# EAGLE design Display (EAGLE 8.4.2)
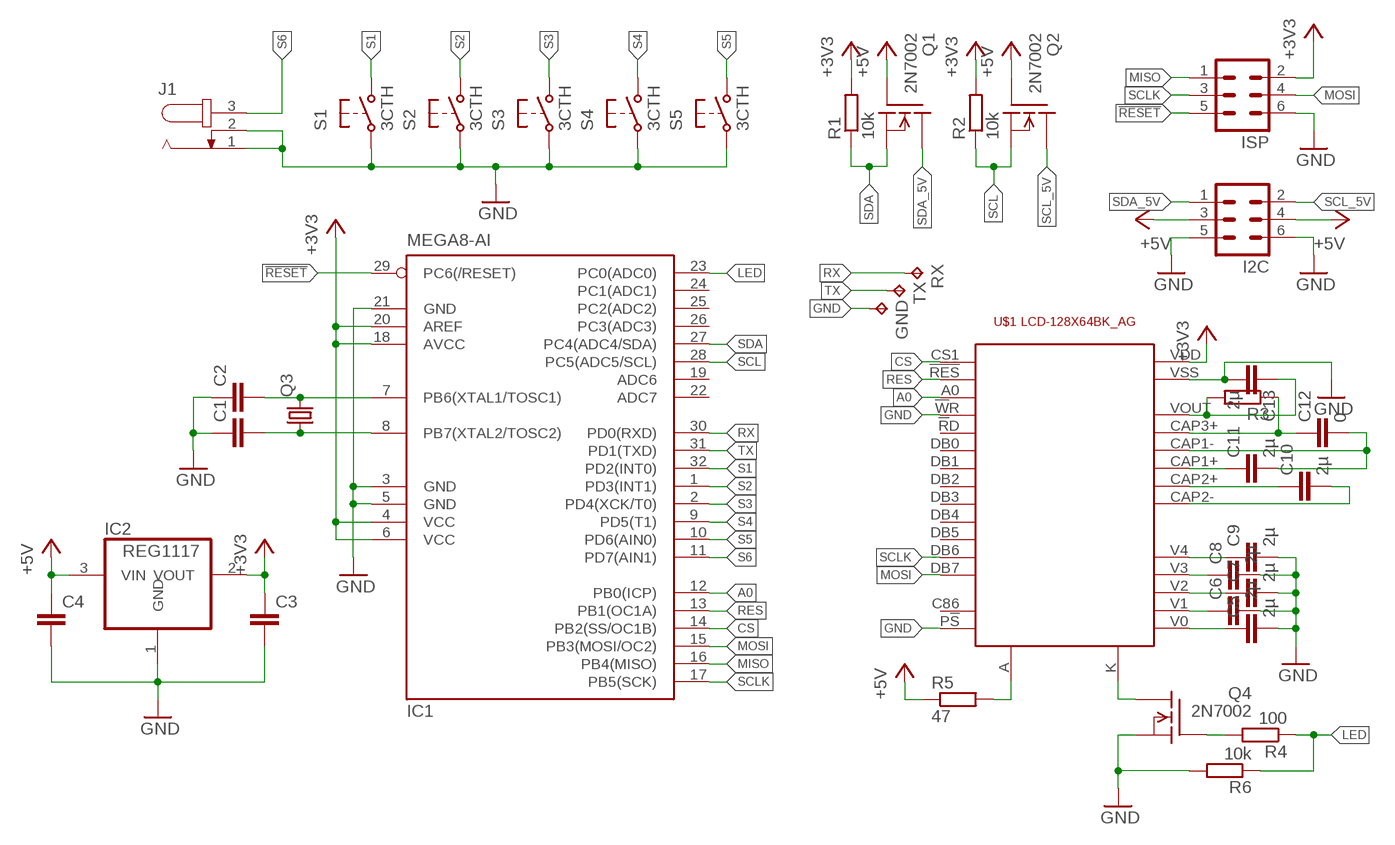
[diagram p0: schematic, sheet 1]

## Parts
C1  C-EUC0805K  [C0805K]
C2  C-EUC0805K  [C0805K]
C3  C-EUC0805K  [C0805K]
C4  C-EUC0805K  [C0805K]
C5  2µ  C-EUC0805K  [C0805K]
C6  2µ  C-EUC0805K  [C0805K]
C7  2µ  C-EUC0805K  [C0805K]
C8  2µ  C-EUC0805K  [C0805K]
C9  2µ  C-EUC0805K  [C0805K]
C10  2µ  C-EUC0805K  [C0805K]
C11  2µ  C-EUC0805K  [C0805K]
C12  0  C-EUC0805K  [C0805K]
C13  2µ  C-EUC0805K  [C0805K]
GND  TPPAD1-13  [P1-13]
I2C  ML6  [ML6]
IC1  MEGA8-AI  [TQFP32-08]
IC2  REG1117  [SOT223]
ISP  ML6  [ML6]
J1  JACK-PLUG0  [SPC4077]
Q1  2N7002  [SOT23]
Q2  2N7002  [SOT23]
Q3  CRYSTALHC49UP  [HC49UP]
Q4  2N7002  [SOT23]
R1  10k  R-EU_R0805  [R0805]
R2  10k  R-EU_R0805  [R0805]
R3  R-EU_R0805  [R0805]
R4  100  R-EU_R0805  [R0805]
R5  47  R-EU_0207/10  [0207/10]
R6  10k  R-EU_R0805  [R0805]
RX  TPPAD1-13  [P1-13]
S1  3CTH  [3CTH]
S2  3CTH  [3CTH]
S3  3CTH  [3CTH]
S4  3CTH  [3CTH]
S5  3CTH  [3CTH]
TX  TPPAD1-13  [P1-13]
U$1  LCD-128X64BK_AG  [LCD-128X64BK_AG]

## Nets
!RESET: IC1.29(PC6(/RESET)) ISP.5
+3V3: C3.1 IC1.4(VCC) IC1.6(VCC) IC1.18(AVCC) IC1.20(AREF) IC2.2(VOUT) ISP.2 R1.2 R2.2 U$1.VDD
+5V: C4.1 I2C.3 I2C.4 IC2.3(VIN) Q1.1(G) Q2.1(G) R5.1
A0: IC1.12(PB0(ICP)) U$1.A0
CS: IC1.14(PB2(SS/OC1B)) U$1.CS1
GND: C1.1 C2.1 C3.2 C4.2 C5.2 C6.2 C7.2 C8.2 C9.2 C13.2 GND.TP I2C.5 I2C.6 IC1.3(GND) IC1.5(GND) IC1.21(GND) IC2.1(GND) ISP.6 J1.1 J1.2 Q4.2(S) R6.2 S1.3(P) S1.4(P) S2.3(P) S2.4(P) S3.3(P) S3.4(P) S4.3(P) S4.4(P) S5.3(P) S5.4(P) U$1.!W!R U$1.P!S U$1.VSS
LED: IC1.23(PC0(ADC0)) R4.1 R6.1
MISO: IC1.16(PB4(MISO)) ISP.1
MOSI: IC1.15(PB3(MOSI/OC2)) ISP.4 U$1.DB7
N$1: Q4.3(D) U$1.K
N$2: C1.2 IC1.8(PB7(XTAL2/TOSC2)) Q3.1
N$3: C2.2 IC1.7(PB6(XTAL1/TOSC1)) Q3.2
N$4: C13.1 R3.2 U$1.VOUT
N$5: Q4.1(G) R4.2
N$6: C12.1 R3.1 U$1.CAP3+
N$7: R5.2 U$1.A
N$8: C11.2 C12.2 U$1.CAP1-
N$9: C11.1 U$1.CAP1+
N$10: C10.1 U$1.CAP2+
N$11: C10.2 U$1.CAP2-
N$14: C9.1 U$1.V4
N$15: C8.1 U$1.V3
N$16: C7.1 U$1.V2
N$17: C6.1 U$1.V1
N$18: C5.1 U$1.V0
RES: IC1.13(PB1(OC1A)) U$1.!RES
RX: IC1.30(PD0(RXD)) RX.TP
S1: IC1.32(PD2(INT0)) S1.1(S) S1.2(S)
S2: IC1.1(PD3(INT1)) S2.1(S) S2.2(S)
S3: IC1.2(PD4(XCK/T0)) S3.1(S) S3.2(S)
S4: IC1.9(PD5(T1)) S4.1(S) S4.2(S)
S5: IC1.10(PD6(AIN0)) S5.1(S) S5.2(S)
S6: IC1.11(PD7(AIN1)) J1.3
SCL: IC1.28(PC5(ADC5/SCL)) Q2.2(S) R2.1
SCL_5V: I2C.2 Q2.3(D)
SCLK: IC1.17(PB5(SCK)) ISP.3 U$1.DB6
SDA: IC1.27(PC4(ADC4/SDA)) Q1.2(S) R1.1
SDA_5V: I2C.1 Q1.3(D)
TX: IC1.31(PD1(TXD)) TX.TP
Unconnected: IC1.19(ADC6) IC1.22(ADC7) IC1.24(PC1(ADC1)) IC1.25(PC2(ADC2)) IC1.26(PC3(ADC3)) U$1.!R!D(/RD) U$1.C86 U$1.DB0 U$1.DB1 U$1.DB2 U$1.DB3 U$1.DB4 U$1.DB5

## Library data of the parts
C1-C13 = resistor:C-EU: CAPACITOR, European symbol
GND RX TX = testpad:TP: Test pad
I2C ISP = con-harting-ml:ML6: HARTING; OC_FARNELL: unknown; OC_NEWARK: unknown
IC1 = atmel:MEGA8: MICROCONTROLLER 8 Kbytes FLASH, 1 kbytes SRAM, 512 bytes EEPROM, USART, 6-channel 10 bit ADC, 2-channel 8 bit ADC Pin compatible with Atmega48, ATMega88, ATMega168 Source: avr.lbr; MPN: ATMEGA8-16AU; OC_FARNELL: 9171371; OC_NEWARK: 73M8863
IC2 = burr-brown:REG1117: 800mA and 1A Low Dropout (LDO) Positive Regulator 1.8V, 2.5V, 2.85V, 3.3V, 5V, and Adj; MPN: REG1117; OC_FARNELL: 1097566; OC_NEWARK: 14P6981
J1 = con-jack:JACK-PLUG: DC POWER JACK Power Jack, DC, Right Angle, Through Hole, Rated 5A at 16VDC, PC Terminals Distributor: Farnell (www.Farnell.de) Drawing: 84N1161.pdf / 84N1162.pdf Manufacturer: SPC Technology (www.spctechnology.com) Type: SPC4077 / SPC 4078; OC_FARNELL: unknown; OC_NEWARK: unknown
Q1 Q2 Q4 = transistors_gaui:2N7002
Q3 = crystal:CRYSTAL: CRYSTAL; OC_FARNELL: unknown; OC_NEWARK: unknown
R1-R6 = resistor:R-EU_: RESISTOR, European symbol
S1-S5 = switch-mec:3CTH: SWITCH TACTILE
U$1 = display-lcd (2):LCD-128X64BK_AG

## Board
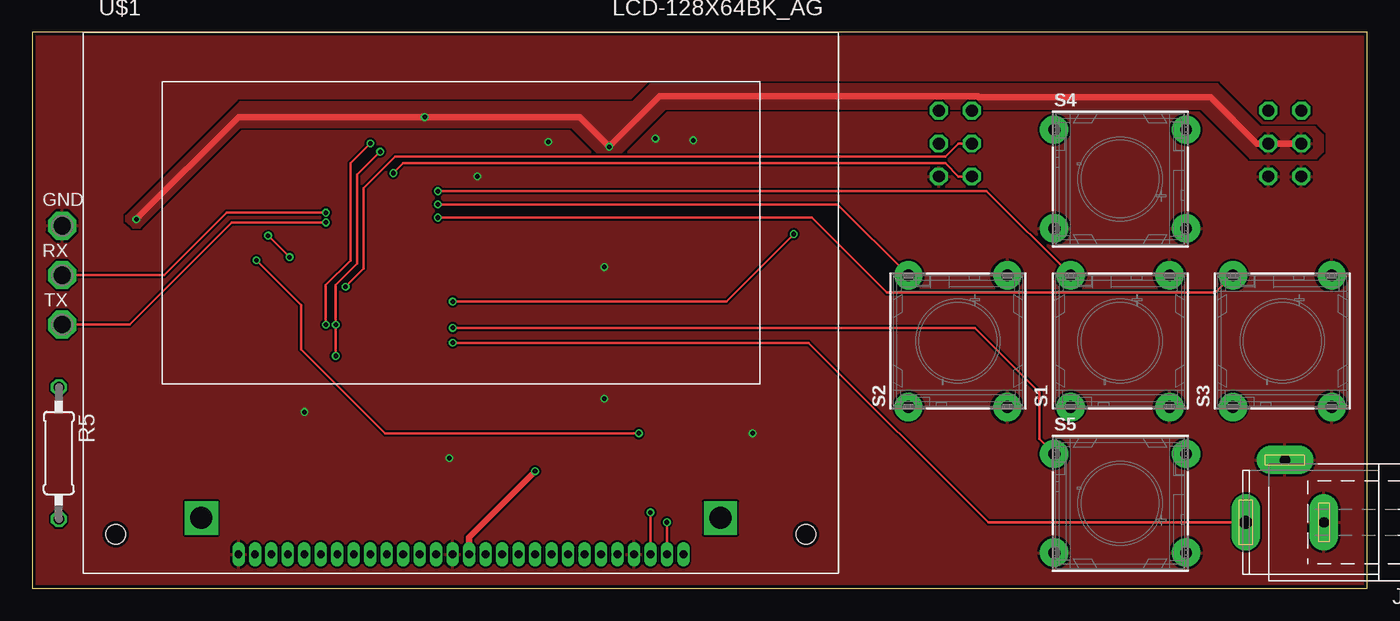
[diagram p1: board, top side]
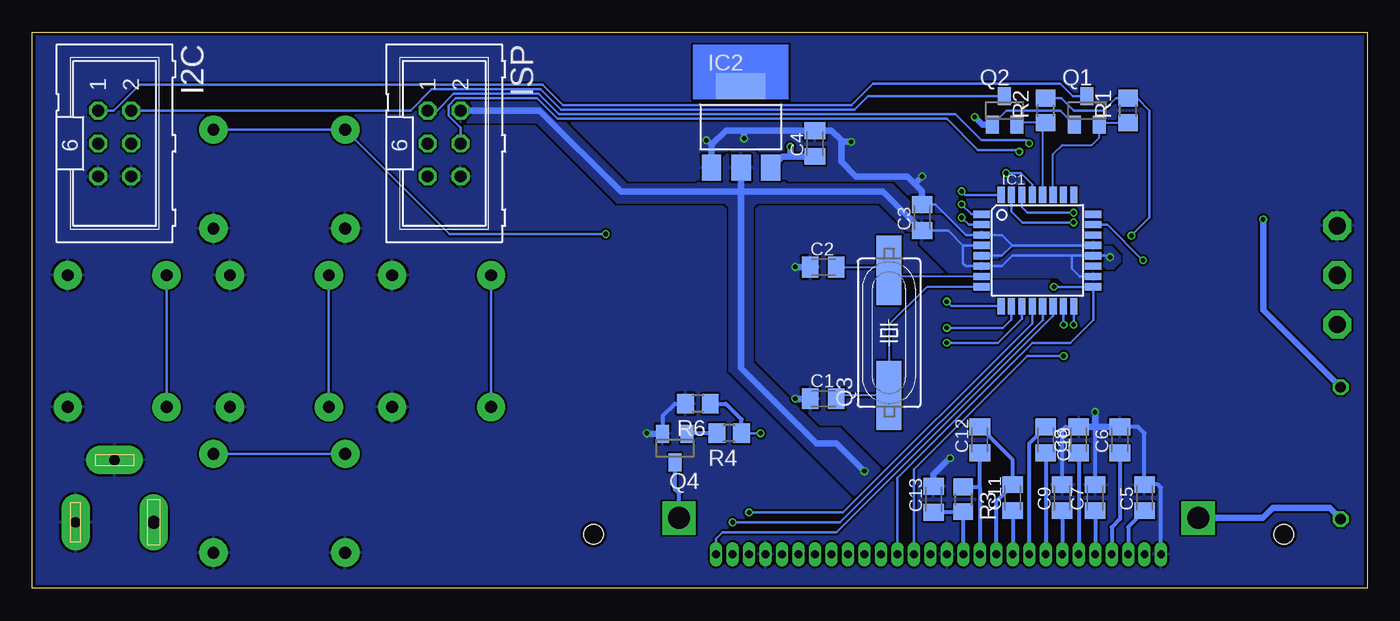
[diagram p2: board, bottom side, seen from below]

Size 102.85 x 42.85 mm. Coordinates in mm from the lower left corner, seen from the top.
Outline: 0,0 102.85,0 102.85,42.85 0,42.85 0,0
Copper layers (1*16): Top 0.018mm / dielectric 1.55mm / Bottom 0.018mm
Design rules "eC_2Layer_PClass6_BaseCopperO18_eCDefault": minimum track width 0.15mm, minimum drill 0.35mm, track to track 0.15mm, track to pad 0.15mm, pad to pad 0.15mm, via to via 0.15mm, smd to smd 0mil, copper to edge 0.25mm, drill to drill 0.35mm, minimum pad ring 0.175mm, minimum via ring 0.125mm, stop-mask expansion 0mil, vias tented up to drill 0.45mm, thermal gap 0.2mm

### Footprints (pad centres in the part's own frame; a part is rotated, then mirrored left to right if it is on the bottom)
C0805K = smd 1.3 x 1.6: 1 -1,0; 2 1,0
P1-13 = drill 1.321 pad 2.159 octagon: TP 0,0
ML6 = drill 0.914 octagon: 1 -2.54,-1.27; 2 -2.54,1.27; 3 0,-1.27; 4 0,1.27; 5 2.54,-1.27; 6 2.54,1.27
TQFP32-08 = smd 1.27 x 0.559: 1 -4.293,2.8; 2 -4.293,2; 3 -4.293,1.2; 4 -4.293,0.4; 5 -4.293,-0.4; 6 -4.293,-1.2; 7 -4.293,-2; 8 -4.293,-2.8; 17 4.293,-2.8; 18 4.293,-2; 19 4.293,-1.2; 20 4.293,-0.4; 21 4.293,0.4; 22 4.293,1.2; 23 4.293,2; 24 4.293,2.8 | smd 0.559 x 1.27: 9 -2.8,-4.293; 10 -2,-4.293; 11 -1.2,-4.293; 12 -0.4,-4.293; 13 0.4,-4.293; 14 1.2,-4.293; 15 2,-4.293; 16 2.8,-4.293; 25 2.8,4.293; 26 2,4.293; 27 1.2,4.293; 28 0.4,4.293; 29 -0.4,4.293; 30 -1.2,4.293; 31 -2,4.293; 32 -2.8,4.293
SOT223 = smd 1.499 x 2.007: 1 -2.261,-3.15; 2 0.025,-3.15; 3 2.311,-3.15 | smd 3.81 x 2.007: 4 0,3.15
SPC4077 = drill 0.8 pad 2.184 long: 1 -3,0; 2 0,-4.8 | drill 1 pad 2.184 long: 3 3,0
SOT23 = smd 1 x 1.4: 1 -0.95,-1.1; 2 0.95,-1.1; 3 0,1.1
HC49UP = smd 5.334 x 1.93: 1 -4.826,0; 2 4.826,0
R0805 = smd 1.3 x 1.5: 1 -0.95,0; 2 0.95,0
0207/10 = drill 0.813 octagon: 1 -5.08,0; 2 5.08,0
3CTH = drill 0.914 pad 2.184: 1 5.08,3.81; 2 -5.08,3.81; 3 5.08,-3.81; 4 -5.08,-3.81
LCD-128X64BK_AG = drill 0.6 long: !R!D 12.065,-20.25; !RES 15.875,-20.25; !W!R 13.335,-20.25; A0 14.605,-20.25; C86 -15.875,-20.25; CAP1+ -5.715,-20.25; CAP1- -4.445,-20.25; CAP2+ -6.985,-20.25; CAP2- -8.255,-20.25; CAP3+ -3.175,-20.25; CS1 17.145,-20.25; DB0 10.795,-20.25; DB1 9.525,-20.25; DB2 8.255,-20.25; DB3 6.985,-20.25; DB4 5.715,-20.25; DB5 4.445,-20.25; DB6 3.175,-20.25; DB7 1.905,-20.25; P!S -17.145,-20.25; V0 -14.605,-20.25; V1 -13.335,-20.25; V2 -12.065,-20.25; V3 -10.795,-20.25; V4 -9.525,-20.25; VDD 0.635,-20.25; VOUT -1.905,-20.25; VSS -0.635,-20.25 | drill 1.7 square: A -20,-17.45; K 20,-17.45 | hole 1.5: -26.6,-18.7; 26.6,-18.7

### Placement (x,y rotation side)
C1  41.91,14.61 0 bottom
C2  41.91,24.77 0 bottom
C3  34.29,28.57 90 bottom
C4  42.55,34.29 90 bottom
C5  17.14,6.99 90 bottom
C6  19.05,11.43 90 bottom
C7  20.95,6.99 90 bottom
C8  22.22,11.43 90 bottom
C9  23.49,6.99 90 bottom
C10  24.76,11.43 270 bottom
C11  27.3,6.99 90 bottom
C12  29.84,11.43 90 bottom
C13  33.4,6.86 90 bottom
GND  2.29,27.94 0 top
I2C  96.52,34.29 270 bottom
IC1  25.4,26.04 0 bottom
IC2  48.26,35.56 0 bottom
ISP  71.12,34.29 270 bottom
J1  96.52,5.08 180 top
Q1  21.59,36.83 0 bottom
Q2  27.94,36.83 0 bottom
Q3  36.83,19.68 90 bottom
Q4  53.34,10.79 180 bottom
R1  18.41,36.83 90 bottom
R2  24.76,36.83 90 bottom
R3  31.11,6.86 270 bottom
R4  49.15,11.94 180 bottom
R5  2.03,10.41 270 top
R6  51.56,14.22 180 bottom
RX  2.29,24.13 0 top
S1  83.82,19.05 90 top
S2  71.32,19.05 90 top
S3  96.32,19.05 90 top
S4  83.82,31.55 0 top
S5  83.82,6.55 0 top
TX  2.29,20.32 0 top
U$1  33.02,22.86 0 top

### Tracks (layer width: path | path; a pad name or v marks a point on that pad's centre or on a via)
!RESET  (via drill 0.35)
  Top 0.2: ISP.5 71.37,31.75 70.36,32.77 28.57,32.77 v27.81,32
  Bottom 0.2: v27.81,32 26.67,32 25.8,31.13 IC1.29
+3V3  (via drill 0.35)
  Top 0.2: v19.81,25.53 v18.16,27.18
  Top 0.508: U$1.VDD 33.66,3.94 v38.73,9.02
  Bottom 0.2: C3.1 32.27,27.57 31.13,26.43 | 22.73,25.64 27.32,25.64 28.12,24.84 IC1.6 30.93,24.84 31.13,25.04 31.13,26.43 | 22.73,25.64 IC1.20 19.92,25.64 v19.81,25.53 | 31.13,26.43 IC1.4 | IC1.18 22.13,24.04 22.73,24.64 22.73,25.64 | R2.2 23.56,37.78 22.61,36.83 20.32,36.83 19.37,37.78 R1.2 17.71,37.78 16.76,36.83 16.76,28.57 v18.16,27.18
  Bottom 0.508: 48.23,30.58 IC2.2 | C3.1 35.23,28.52 35.26,28.52 37.32,30.58 48.23,30.58 | 48.23,30.58 57.51,30.58 63.75,36.83 ISP.2 | v38.73,9.02 40.89,11.18 42.42,11.18 48.23,16.99 48.23,30.58
  pour Bottom (rank 4): 19.05,25.27 19.05,25.65 19.68,26.29 27.18,26.29 28.32,25.15 29.34,25.15 29.84,25.65 29.84,26.67 30.1,26.92 30.99,26.92 32.77,28.7 34.16,28.7 36.58,31.11 44.7,31.11 47.37,33.78 49.02,33.78 49.78,33.02 51.69,31.11 57.02,31.11 63.63,37.72 70.23,37.72 70.74,37.21 70.74,36.45 70.23,35.94 64.01,35.94 57.79,29.72 50.93,29.72 49.53,29.72 49.15,29.34 49.15,16.76 43.31,10.92 39.24,6.86 38.86,6.86 37.21,8.51 37.21,8.89 40.64,12.32 42.29,12.32 47.37,17.4 47.37,20.45 47.37,29.34 46.99,29.72 37.59,29.72 31.88,24 23.88,24 23.11,23.24 20.7,23.24 20.57,23.37 20.57,24.77 20.45,24.89 20.32,24.89 20.07,24.64 19.56,24.64 19.05,25.15
+5V  (via drill 0.35)
  Top 0.508: I2C.3 I2C.4 94.36,34.29 90.81,37.85 72.92,37.85 72.84,37.92 48.33,37.92 v44.45,34.04 42.16,36.32 v30.23,36.32 15.88,36.32 v8,28.45
  Bottom 0.2: Q1.1 23.64,36.83 27.79,36.83 Q2.1
  Bottom 0.508: C4.1 44.32,33.29 | 44.32,33.29 45.07,33.29 IC2.3 | 44.32,33.29 44.45,33.42 v44.45,34.04 | Q2.1 29.63,35.73 v30.23,36.32 | v8,28.45 8,21.46 R5.1
  pour Top (rank 4): 99.44,34.92 98.81,35.56 94.62,35.56 91.31,38.86 47.62,38.86 46.23,37.47 16,37.47 7.24,28.7 7.24,28.32 7.75,27.81 8.26,27.81 16,35.56 41.53,35.56 43.94,33.15 44.96,33.15 48.77,36.96 49.28,36.96 90.04,36.96 93.85,33.15 98.93,33.15 99.44,33.66
A0  (via drill 0.35)
  Top 0.2: v47.62,5.84 U$1.A0
  Bottom 0.2: IC1.12 25.8,20.43 40.39,5.84 v47.62,5.84
CS
  Bottom 0.2: IC1.14 24.2,21 40.88,4.32 49.66,4.32 50.16,3.81 U$1.CS1
GND  (via drill 0.35)
  Bottom 0.2: 27.32,26.43 IC1.21 | 27.32,26.43 28.12,27.23 IC1.3 30.92,27.23 33.26,29.57 C3.2 | IC1.5 28.12,25.64 27.32,26.43
  Bottom 0.305: U$1.P!S 15.88,7.75 16.13,8 17.13,8 C5.2 17.14,11.94 17.65,12.45 19.03,12.45 C6.2 | C7.2 20.95,12.43 | C9.2 23.49,12.19 23.24,12.45 22.24,12.45 C8.2 | R6.2 53.34,14.22 54.29,13.27 Q4.2
  Bottom 0.508: IC2.1 50.52,34.19 | 50.52,34.19 49.42,35.29 C4.2 41.26,35.29 40.51,34.54 40.51,32.89 39.37,31.75 35.43,31.75 34.29,30.61 C3.2 | C6.2 20.95,12.43 | C8.2 20.95,12.43 | v32.13,10.03 33.4,8.76 C13.2 | 20.95,12.43 v20.95,13.59 | C2.1 v44.07,24.77 | C1.1 v44.07,14.61 | Q4.2 55.46,11.89 v55.5,11.94 | 34.86,31.18 v34.29,31.75 | 50.52,34.19 50.88,34.54 v50.93,34.54 | 48.01,35.29 v48.01,34.67 | 40.83,34.86 40.39,34.42 v39.75,34.42
  pour Bottom (rank 6): -0.25,43.05 103.12,43.05 103.12,-0.13 -0.25,-0.13
  pour Top (rank 6): -0.25,43.05 103.12,43.05 103.12,-0.13 -0.25,-0.13
LED  (via drill 0.35)
  Top 0.2: v17.26,25.28 20.7,21.84 20.7,18.41 27.18,11.94 v46.74,11.94
  Bottom 0.2: IC1.23 20.02,28.04 v17.26,25.28 | v46.74,11.94 48.07,11.94 48.2,12.06
  Bottom 0.305: R4.1 48.2,12.06 48.2,13.02 49.4,14.22 R6.1
MISO  (via drill 0.35)
  Top 0.2: v26.04,34.29 24.51,32.77 24.51,25.27 22.61,23.37 v22.61,20.32
  Bottom 0.2: ISP.1 71.67,36.83 70.38,38.12 63.83,38.12 62.26,36.54 31.71,36.54 29.72,34.54 26.29,34.54 v26.04,34.29 | v22.61,20.32 v22.6,20.33 IC1.16
MOSI  (via drill 0.35)
  Top 0.2: v23.37,17.91 v23.37,20.32 23.37,23.37 25.02,25.02 25.02,31.88 v26.8,33.66
  Bottom 0.2: ISP.4 69.85,35.51 70.79,36.44 70.79,37.22 70.24,37.77 63.98,37.77 62.4,36.19 32.38,36.19 29.97,33.78 26.92,33.78 v26.8,33.66 | v23.37,20.32 23.4,20.35 IC1.15 | U$1.DB7 34.92,9.15 26.17,17.91 v23.37,17.91
N$1
  Bottom 0.305: U$1.K 53.02,7.3 53.34,7.62 Q4.3
N$2
  Bottom 0.15: C1.2 40.66,14.86 36.96,14.86 | 36.96,14.86 Q3.1 | IC1.8 33.91,23.23 36.83,20.32 36.83,14.99 36.96,14.86
N$3
  Bottom 0.15: IC1.7 36.35,24.04 Q3.2 37.08,24.77 C2.2
N$4
  Bottom 0.305: U$1.VOUT R3.2 31.16,5.86 C13.1
N$5
  Bottom 0.305: R4.2 52.35,11.94 Q4.1
N$6
  Bottom 0.305: 29.84,7.75 U$1.CAP3+ | 29.84,7.75 C12.1 | R3.1 29.91,7.81 29.84,7.75
N$7
  Bottom 0.508: U$1.A 8.03,5.41 7.26,6.18 2.88,6.18 R5.2
N$8
  Bottom 0.305: U$1.CAP1- 28.57,6.71 C11.2 27.3,9.89 C12.2
N$9
  Bottom 0.305: C11.1 U$1.CAP1+
N$10
  Bottom 0.305: U$1.CAP2+ 26.04,11.16 C10.1
N$11
  Bottom 0.305: C10.2 U$1.CAP2-
N$14
  Bottom 0.305: C9.1 U$1.V4
N$15
  Bottom 0.305: C8.1 U$1.V3
N$16
  Bottom 0.305: C7.1 U$1.V2
N$17
  Bottom 0.305: C6.1 19.05,5.33 19.68,4.7 U$1.V1
N$18
  Bottom 0.305: C5.1 18.41,4.71 U$1.V0
RES  (via drill 0.35)
  Top 0.2: v48.9,5.08 U$1.!RES
  Bottom 0.2: IC1.13 25,20.69 40.61,5.08 v48.9,5.08
RX  (via drill 0.35)
  Top 0.2: v22.61,28.96 14.99,28.96 10.16,24.13 RX.TP
  Bottom 0.2: IC1.30 26.6,29.39 26.16,28.96 v22.61,28.96
S1  (via drill 0.35)
  Top 0.2: v31.24,30.61 73.53,30.61 S1.1
  Bottom 0.2: IC1.32 30.96,30.33 v31.24,30.61 | S1.2 S1.1
S2  (via drill 0.35)
  Top 0.2: v31.24,29.59 62.05,29.59 S2.1
  Bottom 0.2: IC1.1 30.49,28.84 v31.24,29.59 | S2.2 S2.1
S3  (via drill 0.35)
  Top 0.2: v31.24,28.57 60.07,28.57 65.86,22.79 91.17,22.79 S3.1
  Bottom 0.2: IC1.2 30.7,28.04 v31.24,28.57 | S3.2 S3.1
S4  (via drill 0.35)
  Top 0.2: v58.67,27.3 53.47,22.1 v32.38,22.1
  Bottom 0.2: v58.67,27.3 70.69,27.3 S4.2 S4.1 | v32.38,22.1 32.03,21.74 IC1.9
S5  (via drill 0.35)
  Top 0.2: v32.38,20.07 72.64,20.07 77.6,15.11 77.6,11.5 S5.2
  Bottom 0.2: IC1.10 27.4,20.73 28.07,20.07 v32.38,20.07 | S5.1 S5.2
S6  (via drill 0.35)
  Top 0.2: v32.38,18.92 59.82,18.92 73.66,5.08 J1.3
  Bottom 0.2: IC1.11 26.6,20.77 28.45,18.92 v32.38,18.92
SCL
  Bottom 0.15: IC1.28 25,35.65 R2.1 26.84,35.88 Q2.2
SCL_5V
  Bottom 0.2: I2C.2 73.71,36.83 72.08,38.47 63.69,38.47 62.11,36.89 39.52,36.89 38.48,37.93 Q2.3
SCLK  (via drill 0.35)
  Top 0.2: ISP.3 71.37,34.29 70.36,33.27 27.94,33.27 25.53,30.86 25.53,24.64 v24.13,23.24
  Bottom 0.2: U$1.DB6 36.2,8.51 25.78,18.92 22.86,18.92 21.11,20.68 IC1.17 v24.12,23.23 v24.13,23.24
SDA
  Bottom 0.15: IC1.27 24.2,33.46 23.49,34.16 21.21,34.16 20.64,34.73 Q1.2 20.49,35.88 R1.1
SDA_5V
  Bottom 0.2: I2C.1 96.57,36.83 94.59,38.82 63.54,38.82 61.97,37.24 39.72,37.24 38.08,38.88 23.64,38.88 22.69,37.93 Q1.3
TX  (via drill 0.35)
  Top 0.2: v22.61,28.19 15.37,28.19 7.49,20.32 TX.TP
  Bottom 0.2: IC1.31 27.4,29.05 26.54,28.19 v22.61,28.19
(copper drawn outside any net)
  shapes: Bottom area x1